# Altium schematic sheet SENS+LEDS.SchDoc: =DocumentName
size 420 x 297 mm; CompanyName: "AS Manufacturing" LLC; Organization: "AS Manufacturing" LLC; Address1: 5 Sklyarenka St.; Address2: Kyiv 04073; Address3: Ukraine; Address4: https://ajax.systems/en/; DocumentNumber: 4; SheetNumber: 4; SheetTotal: 4; Template_version: 1.0.1
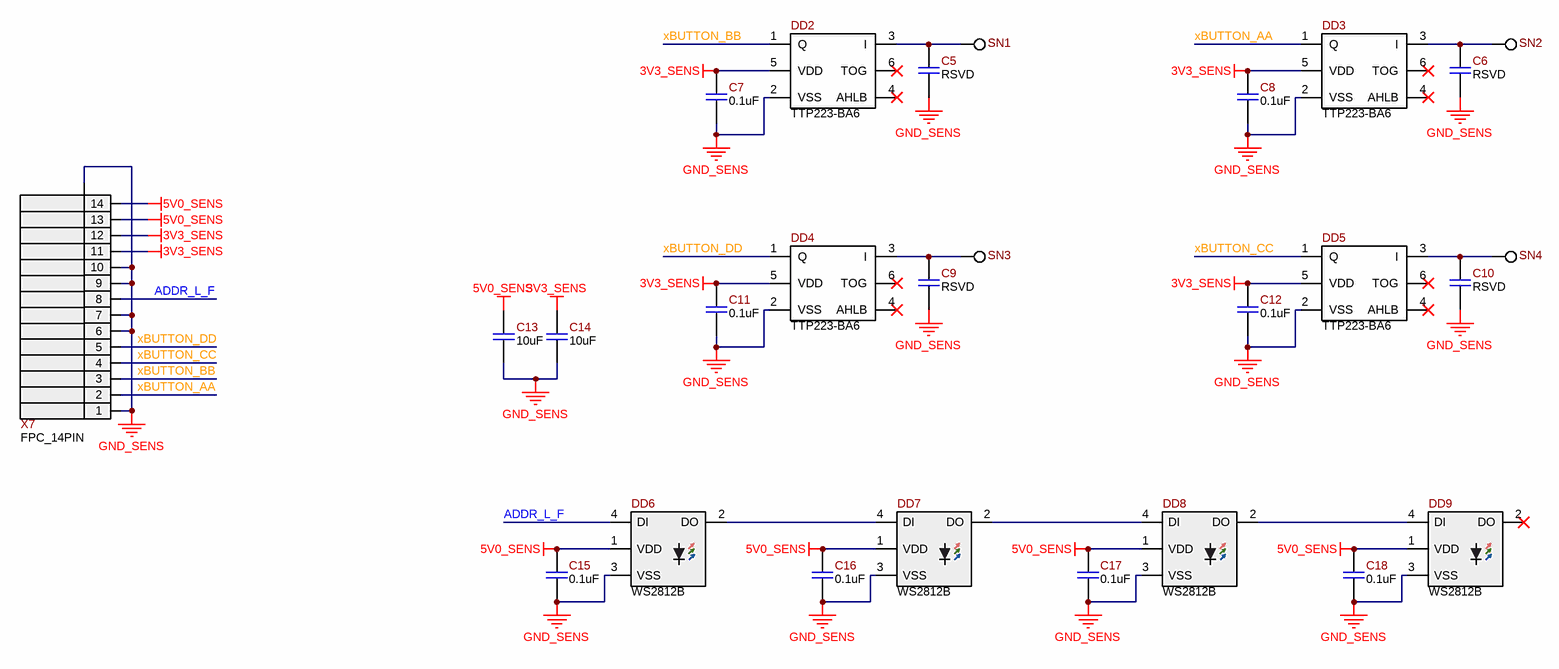
[diagram p0: SENS+LEDS.SchDoc]

## Parts
C5  RSVD  [C0402(1005)]
C6  RSVD  [C0402(1005)]
C7  0.1uF  [C0402(1005)]
C8  0.1uF  [C0402(1005)]
C9  RSVD  [C0402(1005)]
C10  RSVD  [C0402(1005)]
C11  0.1uF  [C0402(1005)]
C12  0.1uF  [C0402(1005)]
C13  10uF  [C0402(1005)]
C14  10uF  [C0402(1005)]
C15  0.1uF  [C0402(1005)]
C16  0.1uF  [C0402(1005)]
C17  0.1uF  [C0402(1005)]
C18  0.1uF  [C0402(1005)]
DD2  TTP223-BA6  [SOT23-6L]
DD3  TTP223-BA6  [SOT23-6L]
DD4  TTP223-BA6  [SOT23-6L]
DD5  TTP223-BA6  [SOT23-6L]
DD6  WS2812B  [WS2812]
DD7  WS2812B  [WS2812]
DD8  WS2812B  [WS2812]
DD9  WS2812B  [WS2812]
SN1  PAD-1.1mm  [PAD-1.1mm]  (value not drawn)  (no BOM)
SN2  PAD-1.1mm  [PAD-1.1mm]  (value not drawn)  (no BOM)
SN3  PAD-1.1mm  [PAD-1.1mm]  (value not drawn)  (no BOM)
SN4  PAD-1.1mm  [PAD-1.1mm]  (value not drawn)  (no BOM)
X7  FPC_14PIN  [FPC-14-0.5mm]

## Nets
3V3_SENS: C7.1 C8.1 C11.1 C12.1 C14.2 DD2.5(VDD) DD3.5(VDD) DD4.5(VDD) DD5.5(VDD) X7.11 X7.12
5V0_SENS: C13.2 C15.1 C16.1 C17.1 C18.1 DD6.1(VDD) DD7.1(VDD) DD8.1(VDD) DD9.1(VDD) X7.13 X7.14
GND_SENS: C5.2 C6.2 C7.2 C8.2 C9.2 C10.2 C11.2 C12.2 C13.1 C14.1 C15.2 C16.2 C17.2 C18.2 DD2.2(VSS) DD3.2(VSS) DD4.2(VSS) DD5.2(VSS) DD6.3(VSS) DD7.3(VSS) DD8.3(VSS) DD9.3(VSS) X7.1 X7.6 X7.7 X7.9 X7.10 X7.15
ADDR_L_F: DD6.4(DI) X7.8
xBUTTON_AA: DD3.1(Q) X7.2
xBUTTON_BB: DD2.1(Q) X7.3
xBUTTON_CC: DD5.1(Q) X7.4
xBUTTON_DD: DD4.1(Q) X7.5
NetC5_1: C5.1 DD2.3(I) SN1.1
NetC6_1: C6.1 DD3.3(I) SN2.1
NetC9_1: C9.1 DD4.3(I) SN3.1
NetC10_1: C10.1 DD5.3(I) SN4.1
NetDD6_2: DD6.2(DO) DD7.4(DI)
NetDD7_2: DD7.2(DO) DD8.4(DI)
NetDD8_2: DD8.2(DO) DD9.4(DI)

Not connected (* = marked no-connect by the designer): DD2 4(AHLB)* 6(TOG)*; DD3 4(AHLB)* 6(TOG)*; DD4 4(AHLB)* 6(TOG)*; DD5 4(AHLB)* 6(TOG)*; DD9 2(DO)*

## Notes on the sheet
- 1
- 2
- 3
- 4
- 5
- 6
- 7
- 8
- A
- B
- C
- D
- E
- F
- Назва проекту
- Мова
- UA
- Розробник
- Формат
- A3
- Версія
- Дата
- Лист
- /

## Library data of the parts
C5-C12 C15-C18 = 0.1uF  25V C0402: CAP CER 0.1UF 25V X7R 0402; Manufacturer: Samsung Electro-Mechanics; Name Component: Capacitor Ceramic; Tolerance: ±10%; Operation Temperature: -55°C ~ 125°C; Library Path 1: Capacitors.SchLib; Part Number: 0.1uF  25V C0402; Value: 0.1uF; Temperature Coefficient: X7R; Power (V/A): 25V; Package/Case: C0402; Supplier Part Number 1: 1276-6854-2-ND; ComponentLink1Description: Datasheet
C13 C14 = 10uF  6.3V C0402: CAP CER 10UF 6.3V X6S 0402; Manufacturer: Murata Electronics North America; Manufacturer P/N: GRM155C80J106ME11D; Name Component: Capacitor Ceramic; Tolerance: ±20%; Operation Temperature: -55°C ~ 105°C; Library Path 1: Capacitors.SchLib; Part Number: 10uF  6.3V C0402; Value: 10uF; Temperature Coefficient: X6S; Power (V/A): 6.3V; Package/Case: C0402; Supplier 1: Digi-key; Supplier Part Number 1: 490-13233-2-ND; ComponentLink1Description: Datasheet; ComponentLink1URL: https://www.murata.com/~/media/webrenewal/support/library/catalog/products/capacitor/mlcc/c02e.ashx?la=en-us
DD2-DD5 = TTP223-BA6: TOUCH SENSOR; Manufacturer: TonTouch; Operation Temperature: -40°C ~ 85°C (TA); Power (V/A): 2...5,5V; Library Path 1: Sensors.SchLib; ComponentDescription: Touch sensor  TTP223-BA6  (SOT-23-6L); Артикул: 5005; Наименование 1С: Микросхема TTP223-BA6; Part Number: TTP223-BA6; Name Component: Touch sensor; Value: TTP223-BA6; Package/Case: SOT-23-6L; Manufacturer P/N: TTP223-BA6; Supplier 1: 3V3; Supplier Part Number 1: TTP223-BA6; ComponentLink1Description: Datasheet; ComponentLink1URL: https://pdf.voron.ua/files/pdf/micoshema/TTP223-BA6_SPEC_V2_1.pdf; AbridgedComponentDescription: TTP223-BA6
DD6-DD9 = WS2812B: ADDRESS LED DISCR SER RGB; Manufacturer: Worldsemi; Name Component: LED Lighting; Operation Temperature: -20 ~ +80; Power (V/A): 1mkA; Library Path 1: Opto.SchLib; Part Number: WS2812B; Value: WS2812B; Package/Case: 5050; Manufacturer P/N: WS2812B; Supplier 1: tme; Supplier Part Number 1: WS2812B; Notes: RGB; ComponentLink1Description: Datasheet; ComponentLink1URL: http://www.seeedstudio.com/document/pdf/WS2812B%20Datasheet.pdf
SN1-SN4 = PAD-1.1mm: 1.1mm Pad for Plug-In or Receptacle; Ajax_1C_PN: NONE; Ajax_1С_Status: RND Only; Component Status: Released; Part Number: PAD-1.1mm; Component Type: PTH; Manufacturer: NONE; Part Type: Pad; Temperature Range: NONE; ComponentLink1URL: NONE; Replacement: NONE; Price: NONE; ComponentLink1Description: Datasheet
X7 = FPC_14PIN: FPC CONNECTOR; Library Path 1: Connectors.SchLib; Part Number: FPC_14PIN; Name Component: FPC_14PIN; Value: FPC_14PIN; ComponentLink1Description: Datasheet